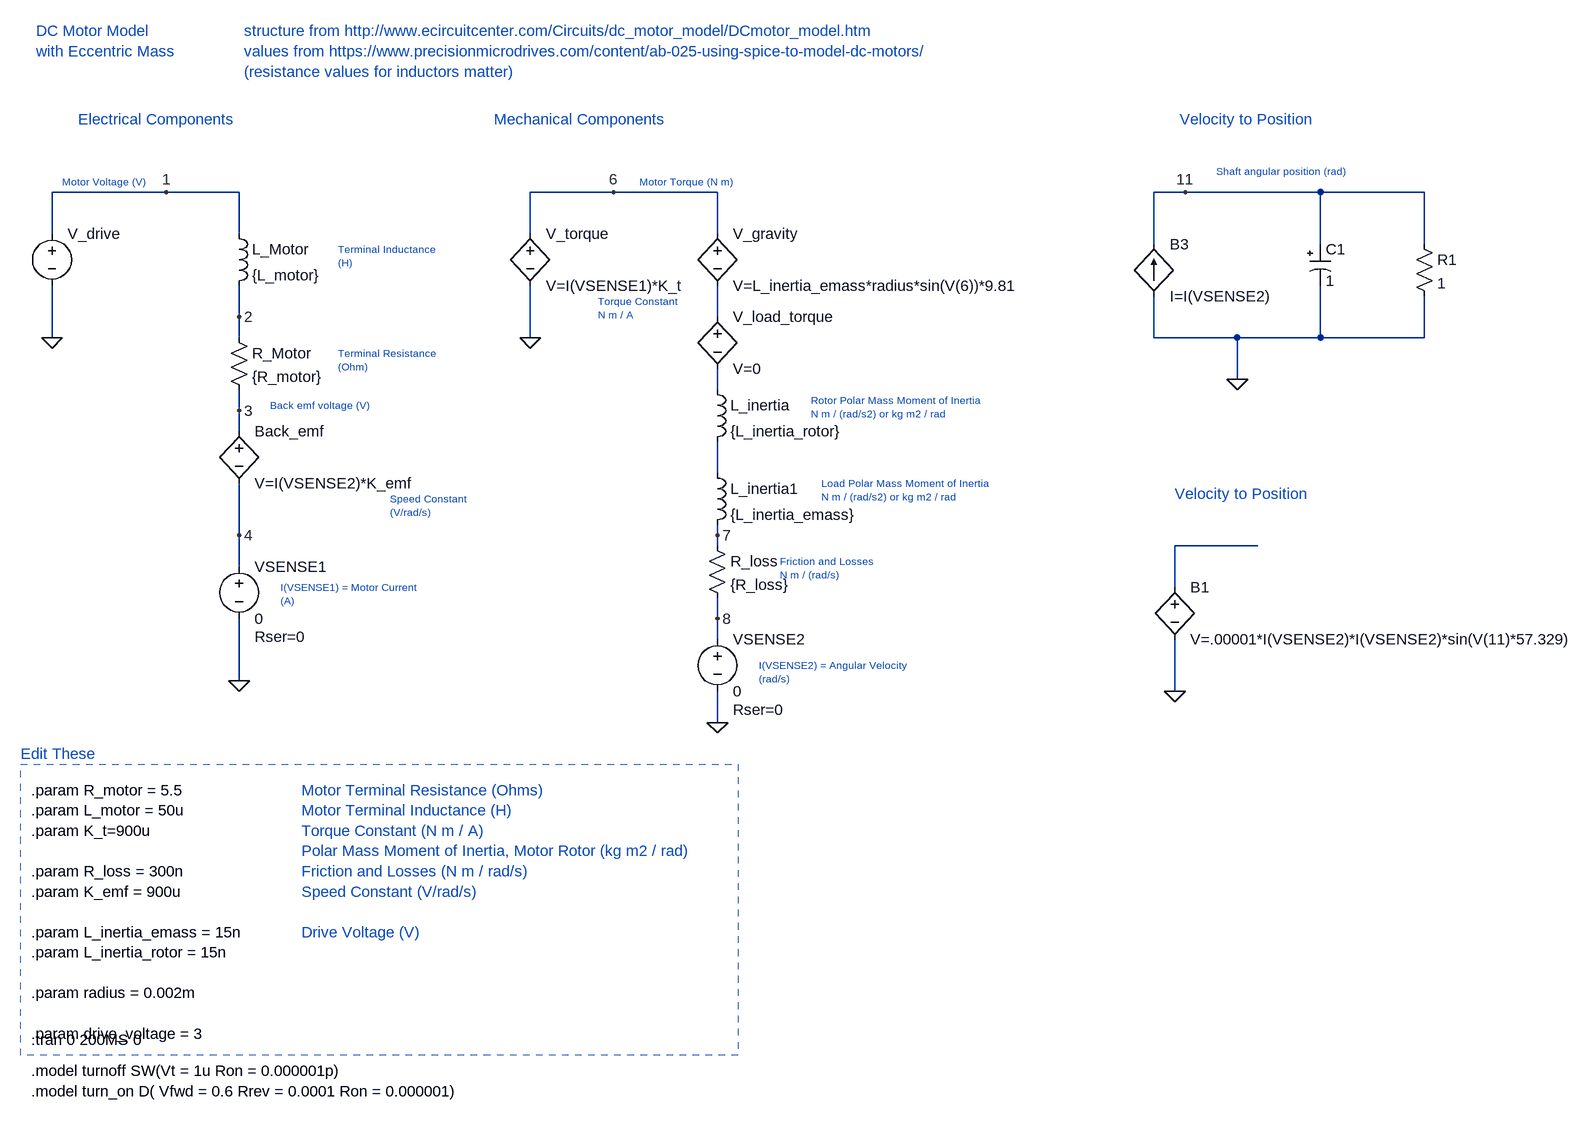
[diagram p0: schematic 2021-10-06_DC_Vibration_Motor_01.asc]
2021-10-06_DC_Vibration_Motor_01.asc, the LTspice schematic file:
Version 4
SHEET 1 3144 1140
WIRE 144 -256 -32 -256
WIRE 256 -256 144 -256
WIRE 832 -256 704 -256
WIRE 992 -256 832 -256
WIRE 1712 -256 1664 -256
WIRE 1920 -256 1712 -256
WIRE 2080 -256 1920 -256
WIRE -32 -192 -32 -256
WIRE 256 -192 256 -256
WIRE 704 -192 704 -256
WIRE 992 -192 992 -256
WIRE 1664 -176 1664 -256
WIRE 1920 -176 1920 -256
WIRE 2080 -176 2080 -256
WIRE 256 -64 256 -112
WIRE 992 -64 992 -112
WIRE -32 -32 -32 -112
WIRE 256 -32 256 -64
WIRE 704 -32 704 -112
WIRE 1664 -32 1664 -96
WIRE 1792 -32 1664 -32
WIRE 1920 -32 1920 -112
WIRE 1920 -32 1792 -32
WIRE 2080 -32 2080 -96
WIRE 2080 -32 1920 -32
WIRE 1792 32 1792 -32
WIRE 992 48 992 16
WIRE 256 80 256 48
WIRE 256 112 256 80
WIRE 992 176 992 128
WIRE 256 272 256 192
WIRE 992 272 992 256
WIRE 992 288 992 272
WIRE 1824 288 1696 288
WIRE 256 320 256 272
WIRE 1696 352 1696 288
WIRE 992 400 992 368
WIRE 992 432 992 400
WIRE 256 496 256 400
WIRE 1696 512 1696 432
WIRE 992 560 992 512
FLAG -32 -32 0
FLAG 256 496 0
FLAG 256 -64 2
FLAG 256 80 3
FLAG 256 272 4
FLAG 704 -32 0
FLAG 992 560 0
FLAG 832 -256 6
FLAG 144 -256 1
FLAG 992 272 7
FLAG 992 400 8
FLAG 1792 32 0
FLAG 1712 -256 11
FLAG 1696 512 0
SYMBOL voltage -32 -208 R0
WINDOW 3 24 44 Invisible 1
WINDOW 123 0 0 Left 0
WINDOW 39 0 0 Left 0
SYMATTR Value PWL(0MS 0 50MS 0 50.1MS {drive_voltage} 150MS {drive_voltage} 150.1MS 0)
SYMATTR InstName V_drive
SYMBOL ind 240 -208 R0
SYMATTR InstName L_Motor
SYMATTR Value {L_motor}
SYMBOL res 240 -48 R0
SYMATTR InstName R_Motor
SYMATTR Value {R_motor}
SYMBOL voltage 256 304 R0
WINDOW 123 0 0 Left 0
WINDOW 39 24 124 Left 2
SYMATTR SpiceLine Rser=0
SYMATTR InstName VSENSE1
SYMATTR Value 0
SYMBOL ind 976 160 R0
SYMATTR InstName L_inertia1
SYMATTR Value {L_inertia_emass}
SYMATTR SpiceLine Rser=0 Rpar=0
SYMBOL res 976 272 R0
SYMATTR InstName R_loss
SYMATTR Value {R_loss}
SYMBOL voltage 992 416 R0
WINDOW 123 0 0 Left 0
WINDOW 39 24 124 Left 2
SYMATTR SpiceLine Rser=0
SYMATTR InstName VSENSE2
SYMATTR Value 0
SYMBOL polcap 1904 -176 R0
SYMATTR InstName C1
SYMATTR Value 1
SYMATTR SpiceLine Rser=0 Lser=0 Rpar=0 Cpar=0
SYMBOL res 2064 -192 R0
SYMATTR InstName R1
SYMATTR Value 1
SYMBOL bv 1696 336 R0
SYMATTR InstName B1
SYMATTR Value V=.00001*I(VSENSE2)*I(VSENSE2)*sin(V(11)*57.329)
SYMBOL bv 256 96 R0
SYMATTR InstName Back_emf
SYMATTR Value V=I(VSENSE2)*K_emf
SYMBOL bv 704 -208 R0
SYMATTR InstName V_torque
SYMATTR Value V=I(VSENSE1)*K_t
SYMBOL bv 992 -208 R0
SYMATTR InstName V_gravity
SYMATTR Value V=L_inertia_emass*radius*sin(V(6))*9.81
SYMBOL ind 976 32 R0
SYMATTR InstName L_inertia
SYMATTR Value {L_inertia_rotor}
SYMATTR SpiceLine Rser=0 Rpar=0
SYMBOL bv 992 -80 R0
SYMATTR InstName V_load_torque
SYMATTR Value V=0
SYMBOL bi2 1664 -176 R0
SYMATTR InstName B3
SYMATTR Value I=I(VSENSE2)
TEXT 264 -504 Left 2 ;structure from http://www.ecircuitcenter.com/Circuits/dc_motor_model/DCmotor_model.htm\nvalues from https://www.precisionmicrodrives.com/content/ab-025-using-spice-to-model-dc-motors/\n(resistance values for inductors matter)
TEXT 8 -368 Left 2 ;Electrical Components
TEXT 648 -368 Left 2 ;Mechanical Components
TEXT -64 1048 Left 2 !.tran 0 200MS 0
TEXT 1152 192 Left 1 ;Load Polar Mass Moment of Inertia\nN m / (rad/s2) or kg m2 / rad
TEXT 1088 312 Left 1 ;Friction and Losses\nN m / (rad/s)
TEXT 808 -88 Left 1 ;Torque Constant\nN m / A
TEXT 408 -8 Left 1 ;Terminal Resistance\n(Ohm)
TEXT 408 -168 Left 1 ;Terminal Inductance\n(H)
TEXT 488 216 Left 1 ;Speed Constant\n(V/rad/s)
TEXT -56 -504 Left 2 ;DC Motor Model\nwith Eccentric Mass
TEXT -16 -272 Left 1 ;Motor Voltage (V)
TEXT 320 352 Left 1 ;I(VSENSE1) = Motor Current\n(A)
TEXT 304 72 Left 1 ;Back emf voltage (V)
TEXT 872 -272 Left 1 ;Motor Torque (N m)
TEXT -64 664 Left 2 !.param R_motor = 5.5\n.param L_motor = 50u\n.param K_t=900u\n \n.param R_loss = 300n\n.param K_emf = 900u\n \n.param L_inertia_emass = 15n\n.param L_inertia_rotor = 15n\n \n.param radius = 0.002m\n \n.param drive_voltage = 3
TEXT 352 664 Left 2 ;Motor Terminal Resistance (Ohms)\nMotor Terminal Inductance (H) \nTorque Constant (N m / A)\nPolar Mass Moment of Inertia, Motor Rotor (kg m2 / rad)\nFriction and Losses (N m / rad/s)\nSpeed Constant (V/rad/s) \n \nDrive Voltage (V)
TEXT -80 608 Left 2 ;Edit These
TEXT 1056 472 Left 1 ;I(VSENSE2) = Angular Velocity\n(rad/s)
TEXT 1704 -368 Left 2 ;Velocity to Position
TEXT 1760 -288 Left 1 ;Shaft angular position (rad)
TEXT 1696 208 Left 2 ;Velocity to Position
TEXT 1136 64 Left 1 ;Rotor Polar Mass Moment of Inertia\nN m / (rad/s2) or kg m2 / rad
TEXT -64 1096 Left 2 !.model turnoff SW(Vt = 1u Ron = 0.000001p)\n.model turn_on D( Vfwd = 0.6 Rrev = 0.0001 Ron = 0.000001)
RECTANGLE Normal 1024 1072 -80 624 2

The netlist it stands for:
* 2021-10-06_DC_Vibration_Motor_01.asc
V_drive 1 0 PWL(0MS 0 50MS 0 50.1MS {drive_voltage} 150MS {drive_voltage} 150.1MS 0)
L_Motor 1 2 {L_motor}
R_Motor 2 3 {R_motor}
VSENSE1 4 0 0 Rser=0
L_inertia1 N003 7 {L_inertia_emass} Rser=0 Rpar=0
R_loss 7 8 {R_loss}
VSENSE2 8 0 0 Rser=0
C1 11 0 1 Rser=0 Lser=0 Rpar=0 Cpar=0
R1 11 0 1
B1 N004 0 V=.00001*I(VSENSE2)*I(VSENSE2)*sin(V(11)*57.329)
Back_emf 3 4 V=I(VSENSE2)*K_emf
B§V_torque 6 0 V=I(VSENSE1)*K_t
B§V_gravity 6 N001 V=L_inertia_emass*radius*sin(V(6))*9.81
L_inertia N002 N003 {L_inertia_rotor} Rser=0 Rpar=0
B§V_load_torque N001 N002 V=0
B3 0 11 I=I(VSENSE2)
* structure from http://www.ecircuitcenter.com/Circuits/dc_motor_model/DCmotor_model.htm
* values from https://www.precisionmicrodrives.com/content/ab-025-using-spice-to-model-dc-motors/
* (resistance values for inductors matter)
* Electrical Components
* Mechanical Components
.tran 0 200MS 0
* Load Polar Mass Moment of Inertia
* N m / (rad/s2) or kg m2 / rad
* Friction and Losses
* N m / (rad/s)
* Torque Constant
* N m / A
* Terminal Resistance
* (Ohm)
* Terminal Inductance
* (H)
* Speed Constant
* (V/rad/s)
* DC Motor Model
* with Eccentric Mass
* Motor Voltage (V)
* I(VSENSE1) = Motor Current
* (A)
* Back emf voltage (V)
* Motor Torque (N m)
.param R_motor = 5.5
.param L_motor = 50u
.param K_t=900u
.param R_loss = 300n
.param K_emf = 900u
.param L_inertia_emass = 15n
.param L_inertia_rotor = 15n
.param radius = 0.002m
.param drive_voltage = 3
* Motor Terminal Resistance (Ohms)
* Motor Terminal Inductance (H)
* Torque Constant (N m / A)
* Polar Mass Moment of Inertia, Motor Rotor (kg m2 / rad)
* Friction and Losses (N m / rad/s)
* Speed Constant (V/rad/s)
* Drive Voltage (V)
* Edit These
* I(VSENSE2) = Angular Velocity
* (rad/s)
* Velocity to Position
* Shaft angular position (rad)
* Velocity to Position
* Rotor Polar Mass Moment of Inertia
* N m / (rad/s2) or kg m2 / rad
.model turnoff SW(Vt = 1u Ron = 0.000001p)
.model turn_on D( Vfwd = 0.6 Rrev = 0.0001 Ron = 0.000001)
.backanno
.end